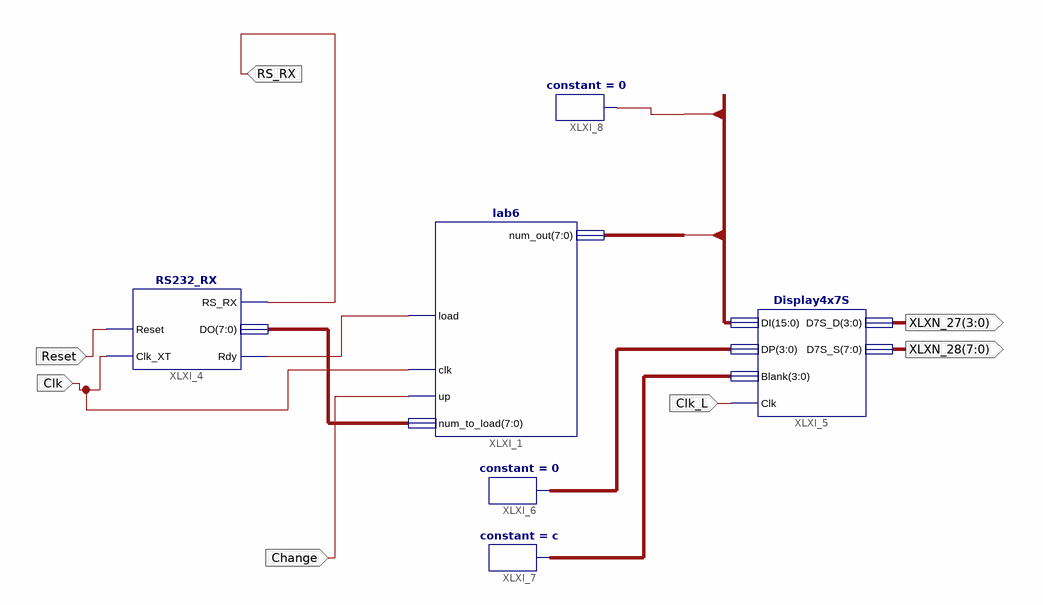
[diagram p0: schematic sheet 1]
// Xilinx ISE schematic lab6.sch (xc9500xl) as structural Verilog: 6 symbols, 7 ports
module lab6 (
  input  Reset,
  input  Clk,
  input  RS_RX,
  input  Change,
  input  Clk_L,
  output [3:0] XLXN_27,
  output [7:0] XLXN_28
);

  wire XLXN_10, XLXN_32_1bit;
  wire [3:0] XLXN_18, XLXN_19;
  wire [7:0] XLXN_5;
  wire [15:0] XLXN_32;

  lab6 XLXI_1 (.load(XLXN_10), .clk(Clk), .up(Change), .num_to_load(XLXN_5), .num_out(XLXN_32[7:0]));
  RS232_RX XLXI_4 (.Reset(Reset), .Clk_XT(Clk), .Rdy(XLXN_10), .DO(XLXN_5), .RS_RX(RS_RX));
  Display4x7S XLXI_5 (.DI(XLXN_32[15:8]), .D7S_D(XLXN_27), .D7S_S(XLXN_28), .DP(XLXN_18), .Clk(Clk_L), .Blank(XLXN_19));
  constant #(.CValue("0")) XLXI_6 (.O(XLXN_18));
  constant #(.CValue("c")) XLXI_7 (.O(XLXN_19));
  constant #(.CValue("0")) XLXI_8 (.O(XLXN_32_1bit));
endmodule
